# EAGLE design 2pcb (EAGLE 9.6.2)
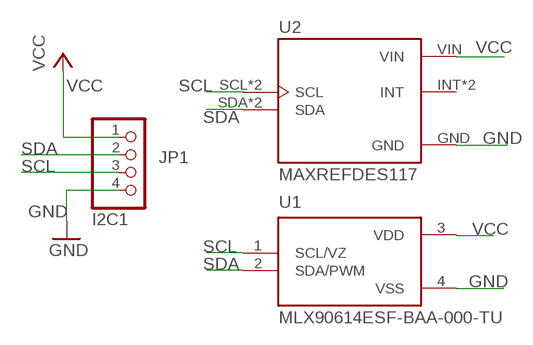
[diagram p0: schematic, sheet 1]

## Parts
JP1  I2C1  PINHD-1X4/90  [1X04/90]
U1  MLX90614ESF-BAA-000-TU  [TO254P942H425-4]
U2  MAXREFDES117  [MODULE_MAXREFDES117]

## Nets
GND: JP1.4 U1.4(VSS) U2.GND
SCL: JP1.3 U1.1(SCL/VZ) U2.SCL U2.SCL1(SCL)
SDA: JP1.2 U1.2(SDA/PWM) U2.SDA U2.SDA1(SDA)
VCC: JP1.1 U1.3(VDD) U2.VIN
Unconnected: U2.INT U2.INT1(INT)

## Library data of the parts
JP1 = pinhead:PINHD-1X4: PIN HEADER
U1 = MLX90614ESF-BAA-000-TU:MLX90614ESF-BAA-000-TU: Temperature Sensor Digital, Infrared (IR) -40°C ~ 85°C 16 b TO-39 Check availability <https://pricing.snapeda.com/parts/MLX90614ESF-BAA-000-TU/Melexis/view-part?ref=eda>; AVAILABILITY: In Stock; DESCRIPTION: Temperature Sensor Digital, Infrared (IR) -40°C ~ 85°C 16 b TO-39; MF: Melexis; MP: MLX90614ESF-BAA-000-TU; PACKAGE: TO-39 Melexis; PRICE: None; PURCHASE-URL: https://pricing.snapeda.com/search/part/MLX90614ESF-BAA-000-TU/?ref=eda
U2 = MAXREFDES117:MAXREFDES117: MAX1921, MAX14595, MAX30102 - Medical, Pulse Oximeter (PO or SpO2) Sensor Evaluation Board Check availability <https://pricing.snapeda.com/parts/MAXREFDES117/Maxim%20Integrated%20Products/view-part?ref=eda>; AVAILABILITY: In Stock; DESCRIPTION: System Board, Heart-Rate And Pulse-Oximetry Monitor; MF: Maxim Integrated Products; MP: MAXREFDES117; PACKAGE: None; PRICE: None; PURCHASE-URL: https://pricing.snapeda.com/search/part/MAXREFDES117/?ref=eda

## Net classes
0 default: width 0.7 mm, drill 0.6 mm, clearance 0.3 mm

## Board
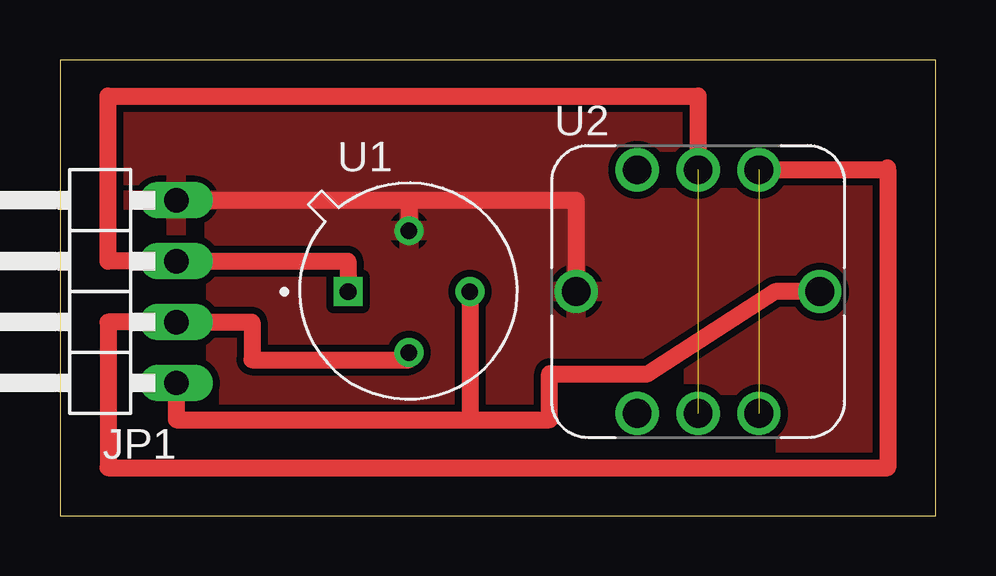
[diagram p1: board, top side]

Size 36.5 x 19 mm. Coordinates in mm from the lower left corner, seen from the top.
Outline: 0,0 36.5,0 36.5,19 0,19 0,0
Copper layers (1*16): Top 0.035mm / dielectric 1.5mm / Bottom 0.035mm
Design rules "default *": minimum track width 6mil, minimum drill 0.35mm, track to track 6mil, track to pad 6mil, pad to pad 6mil, via to via 6mil, smd to smd 6mil, copper to edge 40mil, drill to drill 6mil, minimum pad ring 10mil, minimum via ring 8mil, stop-mask expansion 4mil, vias tented up to drill 0mil, thermal gap 10mil

### Footprints (pad centres in the part's own frame; a part is rotated, then mirrored left to right if it is on the bottom)
1X04/90 = drill 1.016 long: 1 -3.81,-3.81; 2 -1.27,-3.81; 3 1.27,-3.81; 4 3.81,-3.81
TO254P942H425-4 = drill 0.69 pad 1.09 square: 1 -2.54,0 | drill 0.69 pad 1.09: 2 0,-2.54; 3 2.54,0; 4 0,2.54
MODULE_MAXREFDES117 = drill 1.2: GND -5.08,0; INT -2.54,5.08; INT1 -2.54,-5.08; SCL 0,5.08; SCL1 0,-5.08; SDA 2.54,5.08; SDA1 2.54,-5.08; VIN 5.08,0

### Placement (x,y rotation side)
JP1  1.04,9.34 90 top
U1  14.55,9.34 0 top
U2  26.6,9.34 0 top

### Tracks (layer width: path | path; a pad name or v marks a point on that pad's centre or on a via)
GND
  Top 0.7: JP1.4 14.55,13.15 | 14.55,13.15 U1.4 | 14.55,13.15 21.52,13.15 U2.GND
  pour Top: 0,19 36.5,19 36.5,0 0,0
SCL  (1 unrouted)
  Top 0.7: U1.1 12.01,10.61 JP1.3 2,10.61 2,17.5 26.6,17.5 U2.SCL
SDA  (1 unrouted)
  Top 0.7: U1.2 14.55,6.5 8,6.5 8,8.07 JP1.2 2,8.07 2,2 34.5,2 34.5,14.42 | U2.SDA 34.5,14.42 | 34.5,14.42 34.5,14.5
VCC
  Top 0.7: JP1.1 4.85,4 17.09,4 | U1.3 17.09,4 | 17.09,4 20.41,4 20.41,5.91 24.5,5.91 29.82,9.34 U2.VIN